# Altium project ControlBoardwUno_V02.PrjPCB
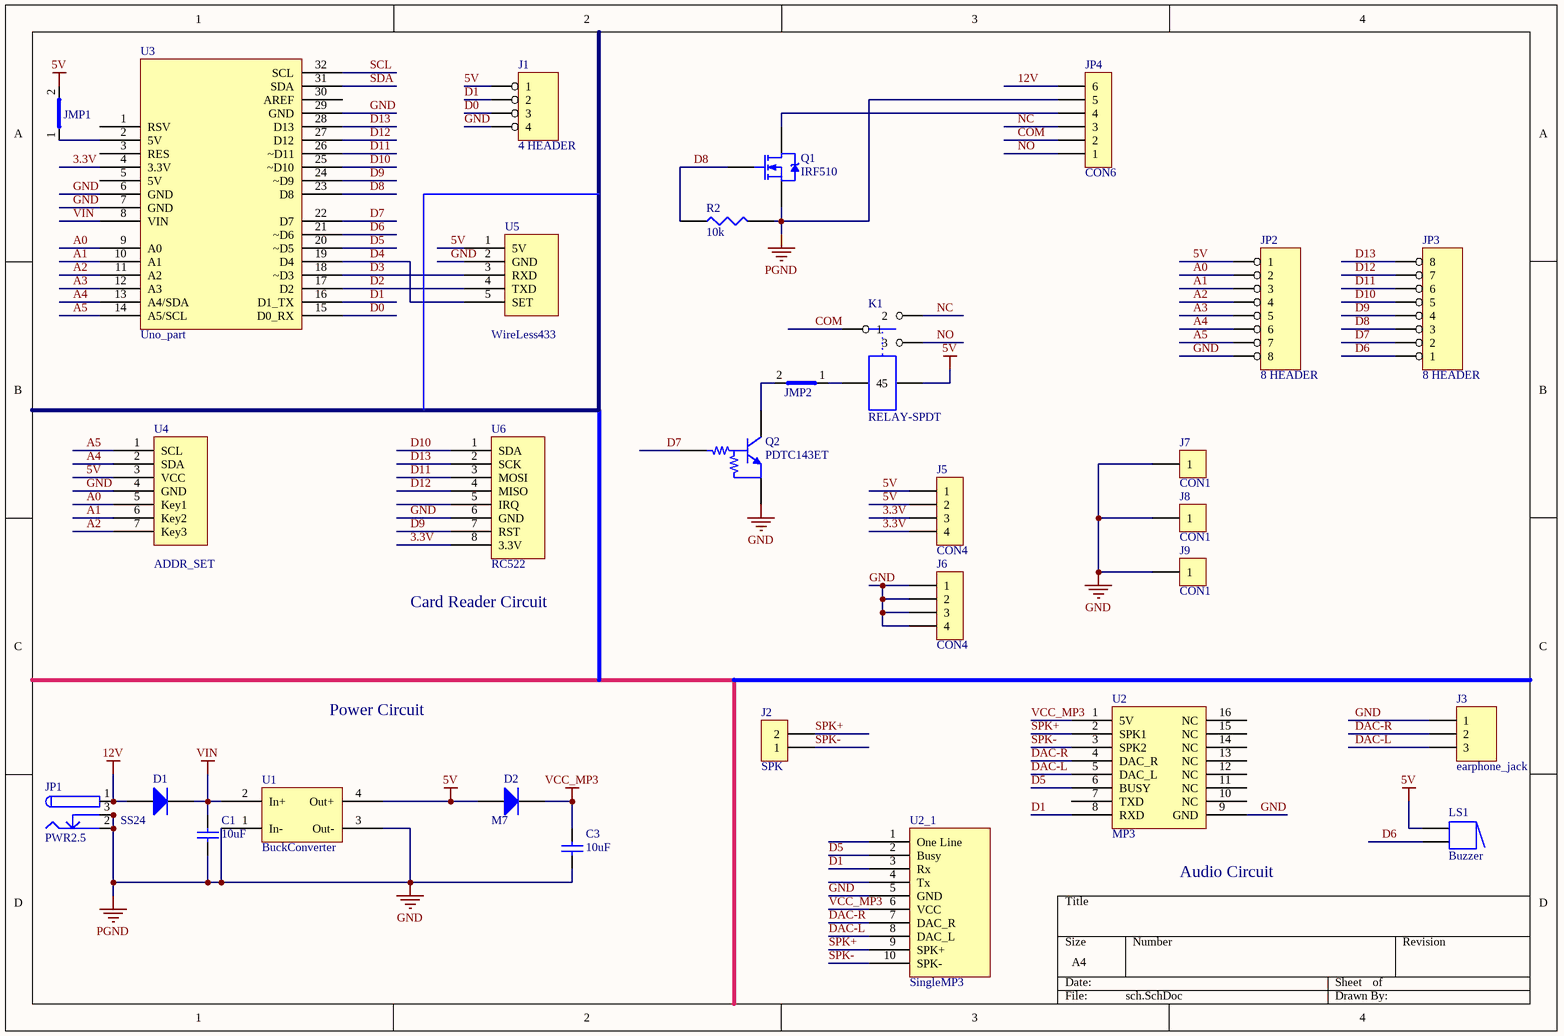
[diagram p0: sch.SchDoc]
1 sheet, 30 parts. Net scope: global (net labels, ports and power ports of the same name join across sheets).
Board file: pcb.PcbDoc

## Sheet sch.SchDoc
size A4

### Parts
C1  value 10uF  [1206]  (hidden comment: Cap Semi)
C3  value 10uF  [1206]  (hidden comment: Cap Semi)
D1  SS24  [SMB]
D2  M7  [SMA]
J1  4 HEADER  [HDR1X4]
J2  SPK  [DG1282]
J3  earphone_jack  [Phone-Jack]
J5  CON4  [SIP4]
J6  CON4  [SIP4]
J7  CON1  [One Pin]
J8  CON1  [One Pin]
J9  CON1  [One Pin]
JMP1  JUMPER  [HDR1X2]  (value not drawn)
JMP2  JUMPER  [HDR1X2]  (value not drawn)
JP1  PWR2.5  [KLD-0202_new]
JP2  8 HEADER  [POWER CONN8]
JP3  8 HEADER  [POWER CONN8]
JP4  CON6  [POWER CONN6]
K1  RELAY-SPDT  [RELAY_SPDT]
LS1  Buzzer  [BUZZ]
Q1  IRF510  [TO-220]
Q2  PDTC143ET  [SOT23]
R2  10k  [1206]
U1  BuckConverter  [BuckConverter]
U2  MP3  [MP3]
U2_1  SingleMP3  [HDR1X10]
U3  Uno_part  [UNO]
U4  ADDR_SET  [HDR1X7]
U5  WireLess433  [HDR1X5]
U6  RC522  [HDR1X8]

### Nets
5V: D2.A J1.1 J5.1 J5.2 JMP1.2(O) JP2.1 K1.5 LS1.1 U1.4(Out+) U4.3(VCC) U5.1(5V)
12V: D1.A JP1.1 JP1.1A JP1.1B JP4.6
GND: C1.1 C3.1 J1.4 J3.1 J6.1 J6.2 J6.3 J6.4 J7.1 J8.1 J9.1 JP1.2 JP1.2A JP1.2B JP1.3 JP1.3A JP1.3B JP2.8 JP4.5 Q1.3(S) Q2.2(E) R2.2 U1.1(In-) U1.3(Out-) U2.9(GND) U2_1.5(GND) U3.6(GND) U3.7(GND) U3.29(GND) U4.4(GND) U5.2(GND) U6.6(GND)  [also labelled PGND]
VCC_MP3: C3.2 D2.K U2.1(5V) U2_1.6(VCC)
VIN: C1.2 D1.K U1.2(In+) U3.8(VIN)
3.3V: J5.3 J5.4 U3.4(3.3V) U6.8(3.3V)
A0: JP2.2 U3.9(A0) U4.5(Key1)
A1: JP2.3 U3.10(A1) U4.6(Key2)
A2: JP2.4 U3.11(A2) U4.7(Key3)
A3: JP2.5 U3.12(A3)
A4: JP2.6 U3.13(A4/SDA) U4.2(SDA)
A5: JP2.7 U3.14(A5/SCL) U4.1(SCL)
COM: JP4.2 K1.1
D0: J1.3 U3.15(D0_RX)
D1: J1.2 U2.8(RXD) U2_1.3(Rx) U3.16(D1_TX)
D2: U3.17(D2) U5.4(TXD)
D3: U3.18(~D3) U5.3(RXD)
D4: U3.19(D4) U5.5(SET)
D5: U2.6(BUSY) U2_1.2(Busy) U3.20(~D5)
D6: JP3.1 LS1.2 U3.21(~D6)
D7: JP3.2 Q2.1(B) U3.22(D7)
D8: JP3.3 Q1.1(G) R2.1 U3.23(D8)
D9: JP3.4 U3.24(~D9) U6.7(RST)
D10: JP3.5 U3.25(~D10) U6.1(SDA)
D11: JP3.6 U3.26(~D11) U6.3(MOSI)
D12: JP3.7 U3.27(D12) U6.4(MISO)
D13: JP3.8 U3.28(D13) U6.2(SCK)
DAC-L: J3.3 U2.5(DAC_L) U2_1.8(DAC_L)
DAC-R: J3.2 U2.4(DAC_R) U2_1.7(DAC_R)
NC: JP4.3 K1.2
NO: JP4.1 K1.3
SCL: U3.32(SCL)
SDA: U3.31(SDA)
SPK+: J2.2 U2.2(SPK1) U2_1.9(SPK+)
SPK-: J2.1 U2.3(SPK2) U2_1.10(SPK-)
NetJMP1_1: JMP1.1(I) U3.2(5V)
NetJMP2_1: JMP2.1(I) K1.4
NetJMP2_2: JMP2.2(O) Q2.3(C)
NetJP4_4: JP4.4 Q1.2(D)

Not connected (* = marked no-connect by the designer): U2 7(TXD) 10(NC) 11(NC) 12(NC) 13(NC) 14(NC) 15(NC) 16(NC); U2_1 1(One_Line) 4(Tx); U3 1(RSV) 3(RES) 5(5V) 30(AREF); U6 5(IRQ)

### Notes on the sheet
- (near U6) Card Reader Circuit
- Power Circuit
- (near U2) Audio Circuit

### Library data of the parts
C1 C3 = Cap Semi: Capacitor (Semiconductor SIM Model); Published: 8-Jun-2000; LatestRevisionDate: 17-Jul-2002; LatestRevisionNote: Re-released for DXP Platform.; PackageReference: C1206; Publisher: Altium Limited
D1 D2 = Diode 1N4001: 1 Amp General Purpose Rectifier; Published: 8-Jun-2000; LatestRevisionDate: 17-Jul-2002; LatestRevisionNote: Re-released for DXP Platform.; DatasheetDocument: 1998; PackageDocument: Aug-1999; PackageReference: DO-41; Publisher: Altium Limited; Code_JEDEC: DO-204-AL; Cost: 0.5
J1 = 4 HEADER: 4 Pin Header
J2 = CON2
J3 = Header 3: Header, 3-Pin; LatestRevisionDate: 17-Jul-2002; LatestRevisionNote: Re-released for DXP Platform.; Publisher: Altium Limited
J5 J6 = CON4: Connector
JP1 = PWR2.5: Low Voltage Power Supply Connector; pin to pad: 1A>1 1B>1 2A>2 2B>2 3A>3 3B>3; Published: 17-Dec-2003; DatasheetDocument: 09-May-2002; Publisher: Altium Limited; ComponentLink1Description: Manufacturer Link; ComponentLink1URL: http://domino.kycon.com/internet/Products.html
JP2 JP3 = 8 HEADER: 8 Pin Header
JP4 = CON6: Connector
LS1 = Buzzer: Magnetic Transducer Buzzer; pin to pad: 1A>1 2A>2; Published: 24-Mar-1999; LatestRevisionDate: 17-Dec-2003; LatestRevisionNote: Schematic revised, PCB Footprint replaced.; DatasheetVersion: 17-Dec-2003; PackageReference: ABSM-1574; Publisher: Altium Limited; ComponentLink1Description: Manufacturer Link; ComponentLink1URL: http://www.megastar.com/linecard/buzzmode/index.php
Q1 = IRF510: HEXFET N-Channel Power MOSFET; Note: Pin 2 is electrically connected to pin 4.; Published: 8-Jun-2000; LatestRevisionDate: 17-Jul-2002; LatestRevisionNote: Re-released for DXP Platform.; DatasheetDocument: PD-9.325Q; PackageDocument: Feb-1997; PackageReference: TO-220AB; Publisher: Altium Limited; Cost: 2
Q2 = PDTC143ET: NPN Resistor-equipped Transistor; pin to pad: 1>B 2>E 3>C; Published: 17-Sep-2003; LatestRevisionDate: 12-Dec-2006; LatestRevisionNote: IPC-7351 Footprint Added.; DatasheetVersion: 15-Apr-1999; PackageVersion: May-1999; PackageReference: SOT23; Publisher: Altium Limited; PackageDescription: 3-Pin SOT-23 Package 0.95 mm Pitch, 2.3 mm Lead Span; ComponentLink1Description: Manufacturer Link; ComponentLink1URL: http://www.semiconductors.philips.com/; ComponentLink2Description: Datasheet; ComponentLink2URL: http://www.semiconductors.philips.com/acrobat/datasheets/PDTC143E_SERIES_9.pdf
R2 = RES1
U2 = MP3: Cost: 15; Website: https://item.taobao.com/item.htm?spm=2013.1.w1031-6089264916.10.9ekZTM&id=40211929619
U3 = Uno_part: Cost: 20
U5 = WireLess433: Cost: 21; Website: https://detail.tmall.com/item.htm?spm=a230r.1.14.28.p06yUE&id=41647104575&ns=1&abbucket=3
U6 = RC522: Cost: 10; Website: https://detail.tmall.com/item.htm?id=41286608549&ali_refid=a3_430583_1006:1109983619:N:MFRC-522:0efdd27495b7e04bcef49b37e14626a1&ali_trackid=1_0efdd27495b7e04bcef49b37e14626a1&spm=a230r.1.14.1.xpelsc